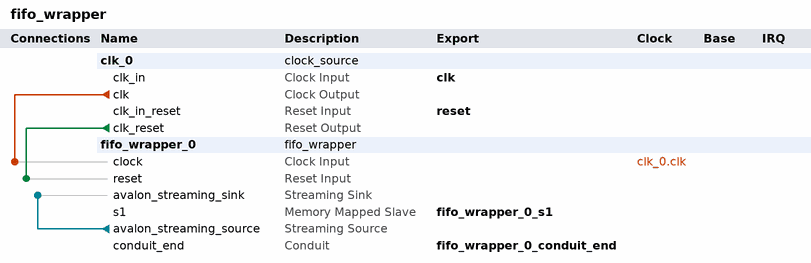
[diagram p0: system contents]
# Platform Designer (Qsys) system fifo_wrapper, Cyclone V 5CSEMA4U23C6
# Parameters at their usual value, and those the tool derives, are not listed.
package require -exact qsys 16.0
create_system fifo_wrapper
set_project_property DEVICE_FAMILY {Cyclone V}
set_project_property DEVICE 5CSEMA4U23C6

add_instance clk_0 clock_source 16.0
set_instance_parameter_value clk_0 clockFrequency 50000000

add_instance fifo_wrapper_0 fifo_wrapper 1.0

# connections
add_connection clk_0.clk fifo_wrapper_0.clock clock
add_connection clk_0.clk_reset fifo_wrapper_0.reset reset
add_connection fifo_wrapper_0.avalon_streaming_source fifo_wrapper_0.avalon_streaming_sink avalon_streaming

# exported interfaces
add_interface clk clock sink
set_interface_property clk EXPORT_OF clk_0.clk_in
add_interface fifo_wrapper_0_conduit_end conduit end
set_interface_property fifo_wrapper_0_conduit_end EXPORT_OF fifo_wrapper_0.conduit_end
add_interface fifo_wrapper_0_s1 avalon slave
set_interface_property fifo_wrapper_0_s1 EXPORT_OF fifo_wrapper_0.s1
add_interface reset reset sink
set_interface_property reset EXPORT_OF clk_0.clk_in_reset

set_interconnect_requirement {$system} qsys_mm.clockCrossingAdapter HANDSHAKE
set_interconnect_requirement {$system} qsys_mm.enableEccProtection FALSE
set_interconnect_requirement {$system} qsys_mm.insertDefaultSlave FALSE
set_interconnect_requirement {$system} qsys_mm.maxAdditionalLatency 1

save_system fifo_wrapper.qsys
